# Altium schematic sheet 1N5819HW-7-F1_1N5819HW-7-F.schdoc
size 127 x 101 mm
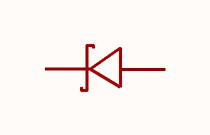
[diagram p0: 1N5819HW-7-F1_1N5819HW-7-F.schdoc]

## Parts
D?  1N5819HW-7-F  [SOD-123_L2.7-W1.6-LS3.7-RD]  (value not drawn)

## Nets

Not connected (* = marked no-connect by the designer): D? 1(K) 2(A)

## Library data of the parts
D? = 1N5819HW-7-F: Manufacturer: DIODES(美台); Add into BOM: yes; Diode Configuration: 1个独立式; Voltage - Forward(Vf@If): 450mV@1A; Voltage - DC Reverse(Vr): 40V; Current - Rectified: 1A; Reverse Leakage Current (Ir): 1mA@40V; Operating Junction Temperature Range: -65℃~+150℃; Non-Repetitive Peak Forward Surge Current: 25A; Symbol: 1N5819HW-7-F; Device: 1N5819HW-7-F; LCSC Part Name: 电压:40V 电流:1A; Supplier Part: C82544; Manufacturer Part: 1N5819HW-7-F; Supplier Footprint: SOD-123; JLCPCB Part Class: Extended Part; Datasheet: https://item.szlcsc.com/datasheet/1N5819HW-7-F/83701.html; Supplier: LCSC; Convert to PCB: yes